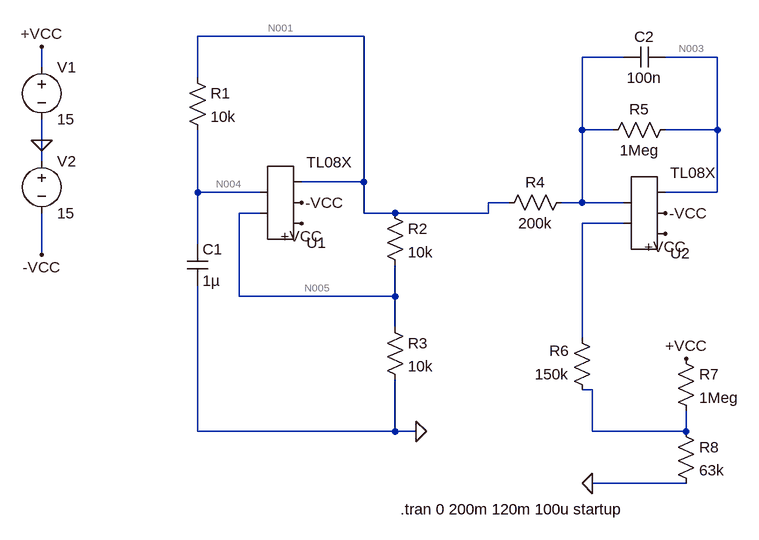
[diagram p0: schematic Ramp_gen.asc]
* Ramp_gen.asc
* U1: TL08X (symbol AutoGenerated\TL08X not available, pins judged from their places): pin1=N005 pin2=N004 pin3=+VCC pin4=-VCC pin5=N001
* U2: TL08X (symbol AutoGenerated\TL08X not available, pins judged from their places): pin1=N006 pin2=N002 pin3=+VCC pin4=-VCC pin5=N003
R1 N001 N004 10k
R2 N001 N005 10k
R3 N005 0 10k
R4 N002 N001 200k
R5 N003 N002 1Meg
R6 N007 N006 150k
C1 N004 0 1µ
C2 N003 N002 100n
V1 +VCC 0 15
V2 0 -VCC 15
R7 +VCC N007 1Meg
R8 N007 0 63k
.tran 0 200m 120m 100u startup
.backanno
.end

* Results of the author's LTspice run, read from the files saved beside the schematic
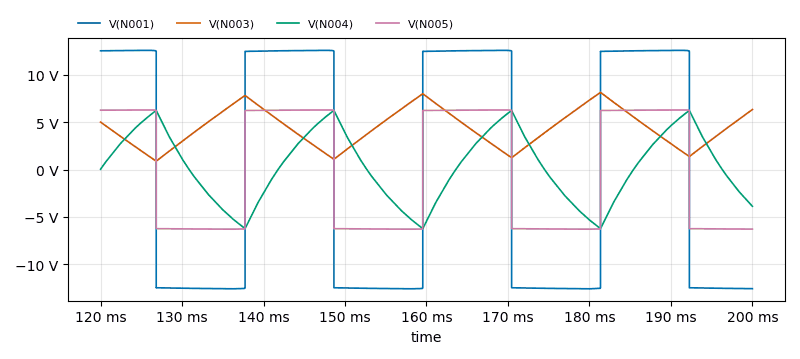
[diagram p1: Transient Analysis of Ramp_gen.asc, plotted from the saved traces]
* Transient Analysis, 1 run:
*   V(N001): min -12.6 V, max 12.6 V, average -139 mV, rms 12.56 V, last -12.59 V
*   V(N003): min 887.6 mV, max 8.16 V, average 4.373 V, rms 4.799 V, last 6.345 V
*   V(N004): min -6.245 V, max 6.246 V, average 352.3 mV, rms 3.759 V, last -3.881 V
*   V(N005): min -6.301 V, max 6.3 V, average -69.48 mV, rms 6.279 V, last -6.293 V